# EAGLE schematic teensy_sync (EAGLE 7.7.0)
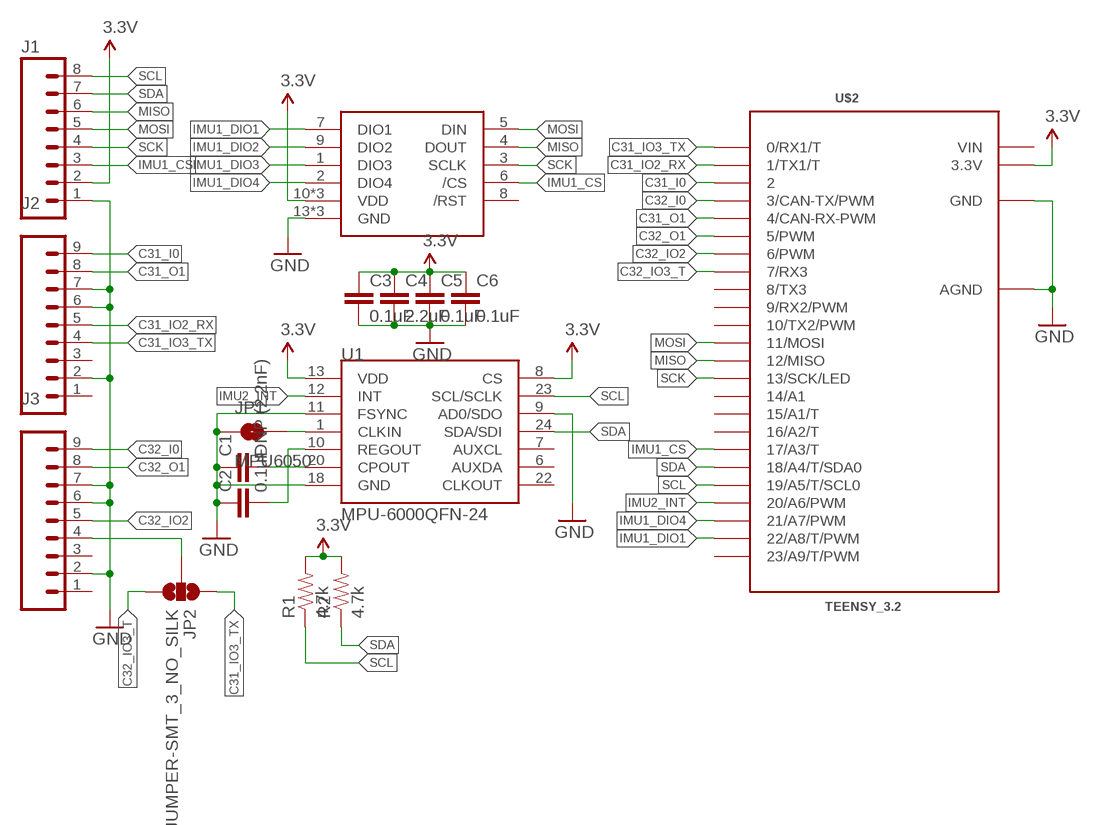
[diagram p0: schematic, sheet 1]

## Parts
C1  DNP (2.2nF)  CAP0402-CAP  [0402-CAP]
C2  0.1uF  CAP0402-CAP  [0402-CAP]
C3  0.1uF  CAP0402-CAP  [0402-CAP]
C4  2.2uF  CAP0402-CAP  [0402-CAP]
C5  0.1uF  CAP0402-CAP  [0402-CAP]
C6  0.1uF  CAP0402-CAP  [0402-CAP]
J1  M08  [1X08_ROUND]
J2  M09  [1X09]
J3  M09  [1X09]
JP1  MPU6050  JUMPER-PAD-2-NOYES_SILK  [PAD-JUMPER-2-NO_YES_SILK]
JP2  JUMPER-SMT_3_NO_SILK  [SMT-JUMPER_3_NO_SILK]
R1  4.7k  RESISTOR0603  [0603-RES]
R2  4.7k  RESISTOR0603  [0603-RES]
U1  MPU-6000QFN-24  [QFN-24-TESTING]
U$1  ADIS16448  [ADIS16448]
U$2  TEENSY_3.2  TEENSY_3.1_DIL  [TEENSY3-DIL]

## Nets
3.3V: C3.1 C4.1 C5.1 C6.1 J1.2 R1.2 R2.2 U1.8(CS) U1.13(VDD) U$1.10(VDD) U$1.11(VDD) U$1.12(VDD) U$2.3.3V
C31_I0: J2.9 U$2.2
C31_IO2_RX: J2.5 U$2.1(1/TX1/T)
C31_IO3_TX: J2.4 JP2.1 U$2.0(0/RX1/T)
C31_O1: J2.8 U$2.4(4/CAN-RX-PWM)
C32_I0: J3.9 U$2.3(3/CAN-TX/PWM)
C32_IO2: J3.5 U$2.6(6/PWM)
C32_IO3: J3.4 JP2.2
C32_IO3_T: JP2.3 U$2.7(7/RX3)
C32_O1: J3.8 U$2.5(5/PWM)
GND: C1.1 C2.1 C3.2 C4.2 C5.2 C6.2 J1.1 J2.2 J2.6 J2.7 J3.2 J3.6 J3.7 JP1.1 U1.9(AD0/SDO) U1.11(FSYNC) U1.18(GND) U$1.13(GND) U$1.14(GND) U$1.15(GND) U$2.AGND U$2.GND
IMU1_CS: J1.3 U$1.6(/CS) U$2.17/A3(17/A3/T)
IMU1_DIO1: U$1.7(DIO1) U$2.22/A8(22/A8/T/PWM)
IMU1_DIO2: U$1.9(DIO2)
IMU1_DIO3: U$1.1(DIO3)
IMU1_DIO4: U$1.2(DIO4) U$2.21/A7(21/A7/PWM)
IMU2_INT: U1.12(INT) U$2.20/A6(20/A6/PWM)
MISO: J1.6 U$1.4(DOUT) U$2.12(12/MISO)
MOSI: J1.5 U$1.5(DIN) U$2.11(11/MOSI)
N$7: C1.2 U1.20(CPOUT)
N$8: JP1.2 U1.1(CLKIN)
REGOUT: C2.2 U1.10(REGOUT)
SCK: J1.4 U$1.3(SCLK) U$2.13(13/SCK/LED)
SCL: J1.8 R1.1 U1.23(SCL/SCLK) U$2.19/A5(19/A5/T/SCL0)
SDA: J1.7 R2.1 U1.24(SDA/SDI) U$2.18/A4(18/A4/T/SDA0)
Unconnected: J2.1 J2.3 J3.1 J3.3 U1.6(AUXDA) U1.7(AUXCL) U1.22(CLKOUT) U$1.8(/RST) U$2.8(8/TX3) U$2.9(9/RX2/PWM) U$2.10(10/TX2/PWM) U$2.14/A0(14/A1) U$2.15/A1(15/A1/T) U$2.16/A2(16/A2/T) U$2.23/A9(23/A9/T/PWM)

## Power pins joined to a net without a drawn wire
VIN: U$2.VIN

## Library data of the parts
C1-C6 = SparkFun-Capacitors:CAP: Capacitor Standard 0603 ceramic capacitor, and 0.1" leaded capacitor.
J1 = SparkFun-Connectors:M08: Header 8 Standard 8-pin 0.1" header. Use with straight break away headers (SKU : PRT-00116), right angle break away headers (PRT-00553), swiss pins (PRT-00743), machine pins (PRT-00117), and female headers (PRT-00115).; PROD_ID: CONN-08437
J2 J3 = SparkFun-Connectors:M09: Header 9 Standard 9-pin 0.1" header. Use with straight break away headers (SKU : PRT-00116), right angle break away headers (PRT-00553), swiss pins (PRT-00743), machine pins (PRT-00117), and female headers (PRT-00115).
JP1 = SparkFun-Passives:JUMPER-PAD-2-NO
JP2 = SparkFun-Jumpers:JUMPER-SMT_3_NO: Normally open jumper This jumper has three pads in close proximity to each other. Apply solder to close the connection(s).
R1 R2 = SparkFun-Resistors:RESISTOR: Resistor Basic schematic elements and footprints for 0603, 1206, and PTH resistors.
U1 = SparkFun-Sensors:MPU-6000: MPU-6000 - I2C address is 0x68 with AD0 low and 0x69 with AD0 high.
U$1 = custom:ADIS16448
U$2 = Teensy_3_and_LC_Series_Boards_v1.1:TEENSY_3.1_DIL: Teensy 3.1 or 3.2 in a DIL Layout.

## Net classes
0 default: clearance 0.205 mm